# Altium schematic sheet Mach_PLC.SchDoc
size A3; Date: *******; ApprovedBy: *******; CheckedBy: None; Author: *******; CompanyName: *******; DrawnBy: V.HIEU; Engineer: *******; Organization: *******; Address2: *******; Address3: *******; Address4: *******; DocumentNumber: Doc Num; Revision: V1.0; Email: truongvanhieu17102005@gmail.com; SheetNumber: 1; SheetTotal: 9; CurrentTime: *******; CurrentDate: *******; Time: *******; DocumentFullPathAndName: *******; DocumentName: *******; ModifiedDate: *******; ImagePath: *******; ProjectName: *******; Application_BuildNumber: *******
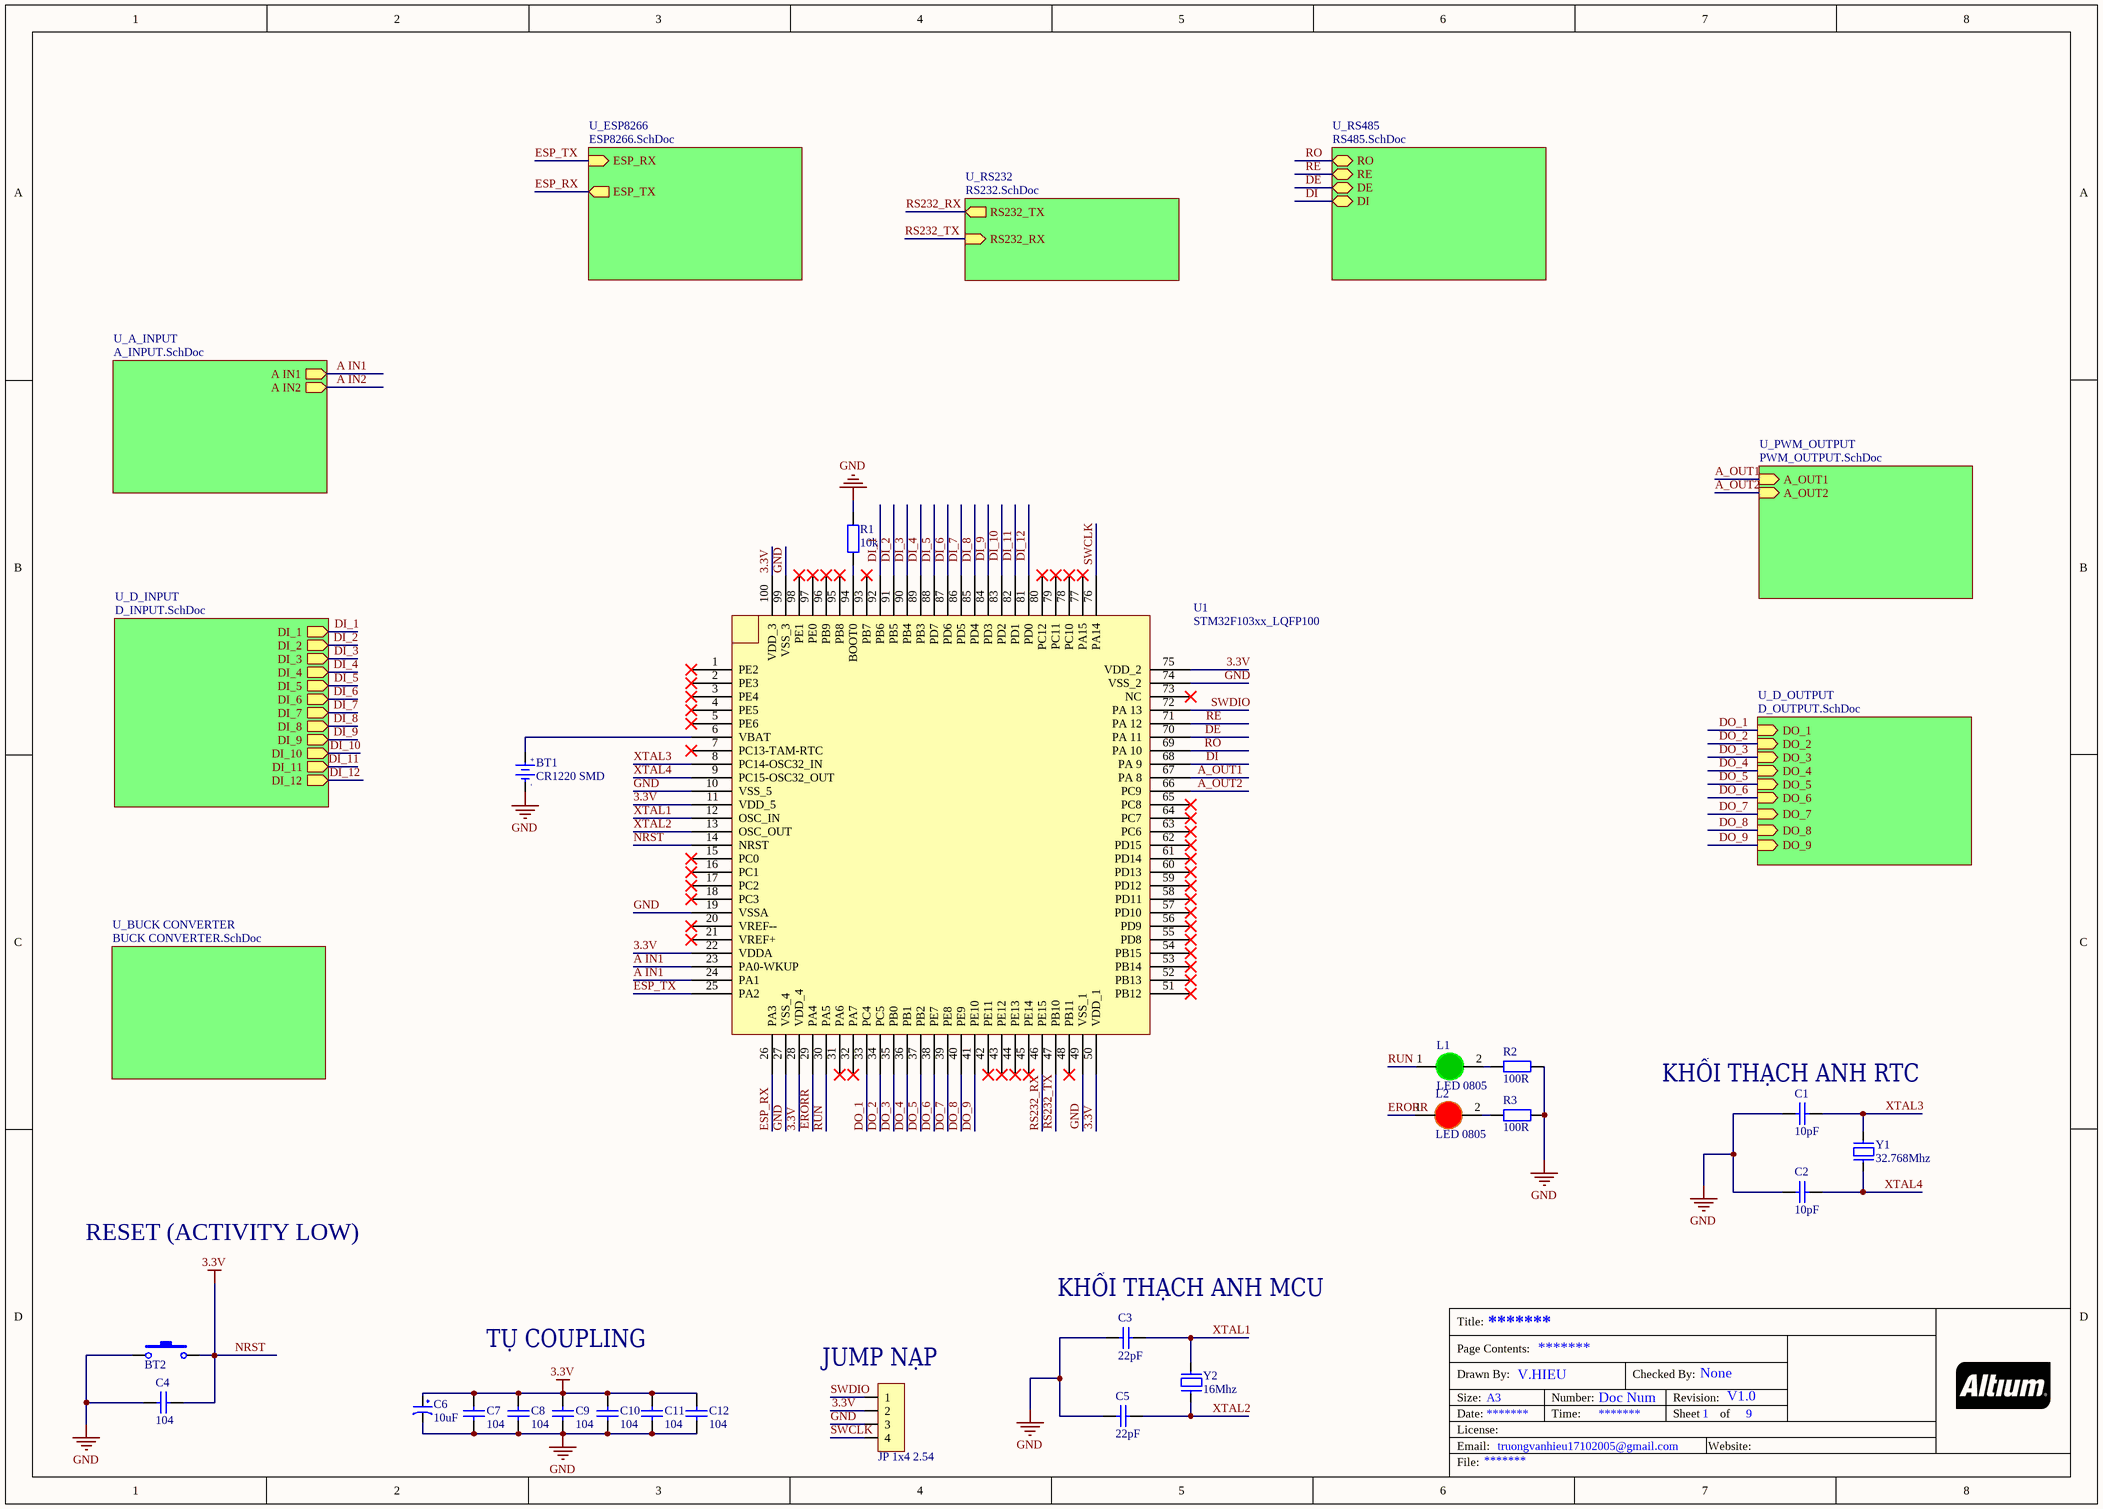
[diagram p0: Mach_PLC.SchDoc]

## Parts
BT1  CR1220 SMD  [DE PIN CR1220]
BT2  Nut Nhan 2 Chan SMD 3x6x2.5  [Nut Nhan 2 Chan SMD 3x6x2.5]  (value not drawn)
C1  10pF  [tu 0805]
C2  10pF  [tu 0805]
C3  22pF  [tu 0805]
C4  104  [tu 0805]
C5  22pF  [tu 0805]
C6  10uF  [tu tantalum smd3216]
C7  104  [tu 0805]
C8  104  [tu 0805]
C9  104  [tu 0805]
C10  104  [tu 0805]
C11  104  [tu 0805]
C12  104  [tu 0805]
JP1  JP 1x4 2.54  [JP 1x4 DT]
L1  LED 0805  [LED-0805-Green]
L2  LED 0805  [LED-0805-Red]
R1  10k  [tro smd 0805]
R2  100R  [tro smd 0805]
R3  100R  [tro smd 0805]
U1  STM32F103xx_LQFP100  [STM32_LQFP100]
Y1  32.768Mhz  [Thach Anh 2 Chan 32,768 KHz]
Y2  16Mhz  [Thach Anh 2 chan SMD]

## Sub-sheets
U_A_INPUT = A_INPUT.SchDoc: A IN1 (out), A IN2 (out)
U_BUCK CONVERTER = BUCK CONVERTER.SchDoc: no entries
U_D_INPUT = D_INPUT.SchDoc: DI_1 (out), DI_2 (out), DI_3 (out), DI_4 (out), DI_5 (out), DI_6 (out), DI_7 (out), DI_8 (out), DI_9 (out), DI_10 (out), DI_11 (out), DI_12 (out)
U_D_OUTPUT = D_OUTPUT.SchDoc: DO_1 (in), DO_2 (in), DO_3 (in), DO_4 (in), DO_9 (in), DO_5 (in), DO_8 (in), DO_7 (in), DO_6 (in)
U_ESP8266 = ESP8266.SchDoc: ESP_TX (out), ESP_RX (in)
U_PWM_OUTPUT = PWM_OUTPUT.SchDoc: A_OUT1 (in), A_OUT2 (in)
U_RS232 = RS232.SchDoc: RS232_RX (in), RS232_TX (out)
U_RS485 = RS485.SchDoc: RO (bidir), RE (bidir), DE (bidir), DI (bidir)

## Nets
3.3V: BT2.2 C4.2 C6.1 C7.1 C8.1 C9.1 C10.1 C11.1 C12.1 JP1.2 U1.11(VDD_5) U1.14(NRST) U1.22(VDDA) U1.28(VDD_4) U1.50(VDD_1) U1.75(VDD_2) U1.100(VDD_3)  [also labelled NRST]
GND: BT1.2(GND) BT2.1 C1.2 C2.2 C3.2 C4.1 C5.2 C6.2 C7.2 C8.2 C9.2 C10.2 C11.2 C12.2 JP1.3 R1.2 R2.2 R3.2 U1.10(VSS_5) U1.19(VSSA) U1.27(VSS_4) U1.49(VSS_1) U1.74(VSS_2) U1.99(VSS_3)
A IN1: U1.23(PA0-WKUP) U1.24(PA1) ; sheet U_A_INPUT/A IN1
A IN2: sheet U_A_INPUT/A IN2
A_OUT1: U1.67(PA_8) ; sheet U_PWM_OUTPUT/A_OUT1
A_OUT2: U1.66(PC9) ; sheet U_PWM_OUTPUT/A_OUT2
DE: U1.70(PA_11) ; sheet U_RS485/DE
DI: U1.68(PA_9) ; sheet U_RS485/DI
DI_1: U1.92(PB6) ; sheet U_D_INPUT/DI_1
DI_2: U1.91(PB5) ; sheet U_D_INPUT/DI_2
DI_3: U1.90(PB4) ; sheet U_D_INPUT/DI_3
DI_4: U1.89(PB3) ; sheet U_D_INPUT/DI_4
DI_5: U1.88(PD7) ; sheet U_D_INPUT/DI_5
DI_6: U1.87(PD6) ; sheet U_D_INPUT/DI_6
DI_7: U1.86(PD5) ; sheet U_D_INPUT/DI_7
DI_8: U1.85(PD4) ; sheet U_D_INPUT/DI_8
DI_9: U1.84(PD3) ; sheet U_D_INPUT/DI_9
DI_10: U1.83(PD2) ; sheet U_D_INPUT/DI_10
DI_11: U1.82(PD1) ; sheet U_D_INPUT/DI_11
DI_12: U1.81(PD0) ; sheet U_D_INPUT/DI_12
DO_1: U1.33(PC4) ; sheet U_D_OUTPUT/DO_1
DO_2: U1.34(PC5) ; sheet U_D_OUTPUT/DO_2
DO_3: U1.35(PB0) ; sheet U_D_OUTPUT/DO_3
DO_4: U1.36(PB1) ; sheet U_D_OUTPUT/DO_4
DO_5: U1.37(PB2) ; sheet U_D_OUTPUT/DO_5
DO_6: U1.38(PE7) ; sheet U_D_OUTPUT/DO_6
DO_7: U1.39(PE8) ; sheet U_D_OUTPUT/DO_7
DO_8: U1.40(PE9) ; sheet U_D_OUTPUT/DO_8
DO_9: U1.41(PE10) ; sheet U_D_OUTPUT/DO_9
ERORR: L2.1(A) U1.29(PA4)
ESP_RX: U1.26(PA3) ; sheet U_ESP8266/ESP_TX
ESP_TX: U1.25(PA2) ; sheet U_ESP8266/ESP_RX
RE: U1.71(PA_12) ; sheet U_RS485/RE
RO: U1.69(PA_10) ; sheet U_RS485/RO
RS232_RX: U1.46(PE15) ; sheet U_RS232/RS232_TX
RS232_TX: U1.47(PB10) ; sheet U_RS232/RS232_RX
RUN: L1.1(A) U1.30(PA5)
SWCLK: JP1.4 U1.76(PA14)
SWDIO: JP1.1 U1.72(PA_13)
XTAL1: C3.1 U1.12(OSC_IN) Y2.2
XTAL2: C5.1 U1.13(OSC_OUT) Y2.1
XTAL3: C1.1 U1.8(PC14-OSC32_IN) Y1.2
XTAL4: C2.1 U1.9(PC15-OSC32_OUT) Y1.1
NetBT1_1: BT1.1(+3V) U1.6(VBAT)
NetL1_2: L1.2(K) R2.1
NetL2_2: L2.2(K) R3.1
NetR1_1: R1.1 U1.94(BOOT0)

Not connected (* = marked no-connect by the designer): U1 1(PE2)* 2(PE3)* 3(PE4)* 4(PE5)* 5(PE6)* 7(PC13-TAM-RTC)* 15(PC0)* 16(PC1)* 17(PC2)* 18(PC3)* 20(VREF--)* 21(VREF+)* 31(PA6)* 32(PA7)* 42(PE11)* 43(PE12)* 44(PE13)* 45(PE14)* 48(PB11)* 51(PB12)* 52(PB13)* 53(PB14)* 54(PB15)* 55(PD8)* 56(PD9)* 57(PD10)* 58(PD11)* 59(PD12)* 60(PD13)* 61(PD14)* 62(PD15)* 63(PC6)* 64(PC7)* 65(PC8)* 73(NC)* 77(PA15)* 78(PC10)* 79(PC11)* 80(PC12)* 93(PB7)* 95(PB8)* 96(PB9)* 97(PE0)* 98(PE1)*

## Notes on the sheet
- (near C1) KHỐI THẠCH ANH RTC
- RESET (ACTIVITY LOW)
- (near C3) KHỐI THẠCH ANH MCU
- TỤ COUPLING
- (near JP1) JUMP NẠP
- Title:
- Size:
- Drawn By:
- Page Contents:
- A3
- Number:
- Checked By:
- Revision:
- Date:
- File:
- License:
- Email:
- Time:
- Sheet
- Website:
- of
- (in symbol De pin CR1220 SMD) +; -

## Library data of the parts
BT1 = De pin CR1220 SMD: Ten: Đế PIN CR1220 SMD; Ma_Hang: MH000833
BT2 = Nut Nhan 2 Chan SMD 3x6x2.5: Ma_Hang: MH001036; Ten: Nút Nhấn 2 Chân 3x6x2.5MM SMD
C1 C2 = Tu 0805 10pF 50V 10%: Dán; Don_Vi: Con; So_Chan: 2; Ten_Linh_Kien: Tụ 0805 10P 10% 50V; Ma_Hang: MH004554; Chung_Loai: Dán; Kieu_Chan: *
C3 C5 = Tu 0805 22pF 50V 10%: Dán; Don_Vi: Con; So_Chan: 2; Ten_Linh_Kien: Tụ 0805 22P 10% 50V; Ma_Hang: MH004560; Chung_Loai: Dán; Kieu_Chan: *
C4 C7-C12 = Tu 0805 104 50V 10%: Dán; Don_Vi: Con; So_Chan: 2; Ten_Linh_Kien: Tụ 0805 104-100nF 10% 50V; Ma_Hang: MH004551; Chung_Loai: Dán; Kieu_Chan: *
C6 = Tu tantalum 10uF 16V SMD3216: Dán; Don_Vi: Con; So_Chan: 2; Ten_Linh_Kien: Tụ tantalum 106C-10uF 16V SMD3216; Ma_Hang: MH001954; Chung_Loai: Dán; Kieu_Chan: *
JP1 = JP 1x4 2.54 Duc Thang: Cắm; Ten_Linh_Kien: Jump Đơn Đực 2.54MM 1x40P Thẳng 11MM; Don_Vi: Con; Ma_Hang: MH000903; Ghi_Chu: *; Kieu_Chan: *; Chung_Loai: Cắm
L1 = LED 0805 Xanh La: Dán; Don_Vi: Con; Ma_Hang: MH002326; Ten_Linh_Kien: LED 0805 Màu Xanh Lá (Green); Ghi_Chu: *; Kieu_Chan: *; Chung_Loai: Dán
L2 = LED 0805 Do: Dán; Don_Vi: Con; Ma_Hang: MH000897; Ten_Linh_Kien: LED 0805 Màu Đỏ (Red); Ghi_Chu: *; Kieu_Chan: *; Chung_Loai: Dán
R1 = Tro 0805 1% 10k: Dán; Don_Vi: Con; So_Chan: 2; Ten_Linh_Kien: Trở 0805 1% 10k; Ma_Hang: MH005473; Chung_Loai: Dán; Kieu_Chan: *
R2 R3 = Tro 0805 5% 100R: Dán; Don_Vi: Con; So_Chan: 2; Ten_Linh_Kien: Trở 0805 5% 100R; Ma_Hang: MH005251; Chung_Loai: Dán; Kieu_Chan: *
Y1 = Thach Anh 2 chan 32,768 Khz: Crystal For all Crystal 2pin.; Value: 4Mhz
Y2 = Thach Anh 2 chan SMD: Crystal For all Crystal 2pin.; Value: 4Mhz